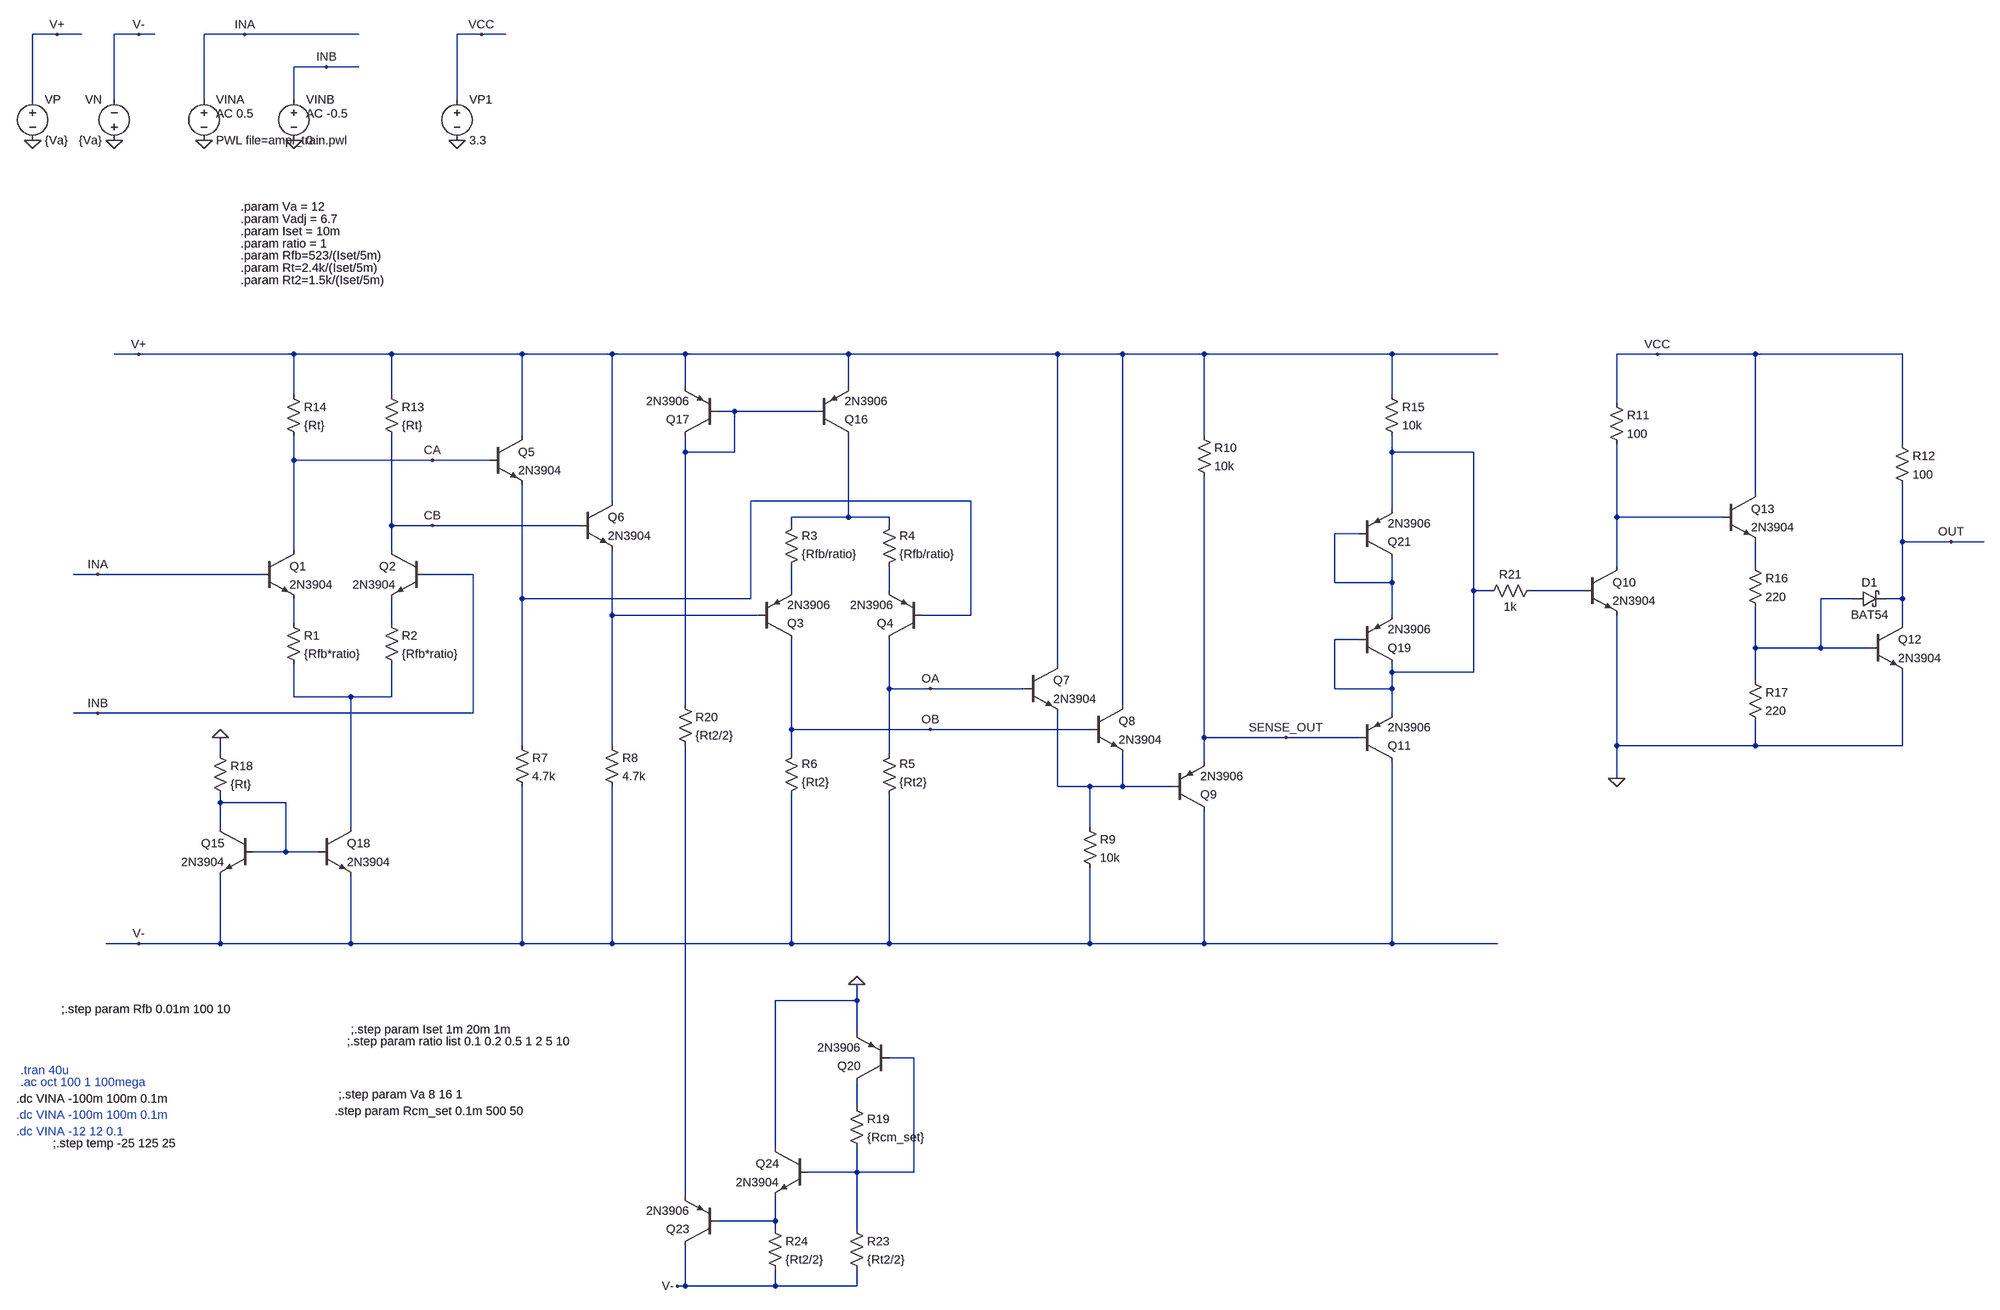
[diagram p0: schematic sense_amp_learning1.asc]
sense_amp_learning1.asc, the LTspice schematic file:
Version 4.1
SHEET 1 4868 1788
WIRE -224 -1328 -272 -1328
WIRE -176 -1328 -224 -1328
WIRE -64 -1328 -112 -1328
WIRE -32 -1328 -64 -1328
WIRE 144 -1328 64 -1328
WIRE 368 -1328 144 -1328
WIRE 608 -1328 560 -1328
WIRE 656 -1328 608 -1328
WIRE 304 -1264 240 -1264
WIRE 368 -1264 304 -1264
WIRE -272 -1200 -272 -1328
WIRE -112 -1200 -112 -1328
WIRE 64 -1200 64 -1328
WIRE 240 -1200 240 -1264
WIRE 560 -1200 560 -1328
WIRE -64 -272 -112 -272
WIRE 240 -272 -64 -272
WIRE 432 -272 240 -272
WIRE 688 -272 432 -272
WIRE 864 -272 688 -272
WIRE 1008 -272 864 -272
WIRE 1328 -272 1008 -272
WIRE 1744 -272 1328 -272
WIRE 1872 -272 1744 -272
WIRE 2032 -272 1872 -272
WIRE 2400 -272 2032 -272
WIRE 2608 -272 2400 -272
WIRE 2944 -272 2864 -272
WIRE 3216 -272 2944 -272
WIRE 3504 -272 3216 -272
WIRE 1008 -208 1008 -272
WIRE 1328 -208 1328 -272
WIRE 240 -192 240 -272
WIRE 432 -192 432 -272
WIRE 2400 -192 2400 -272
WIRE 2864 -176 2864 -272
WIRE 1104 -160 1072 -160
WIRE 1264 -160 1104 -160
WIRE 688 -112 688 -272
WIRE 2032 -112 2032 -272
WIRE 3504 -96 3504 -272
WIRE 1008 -80 1008 -112
WIRE 1104 -80 1104 -160
WIRE 1104 -80 1008 -80
WIRE 2400 -80 2400 -112
WIRE 2560 -80 2400 -80
WIRE 240 -64 240 -112
WIRE 512 -64 240 -64
WIRE 624 -64 512 -64
WIRE 3216 0 3216 -272
WIRE 864 16 864 -272
WIRE 1568 16 1136 16
WIRE 2400 32 2400 -80
WIRE 1328 48 1328 -112
WIRE 1328 48 1216 48
WIRE 1408 48 1328 48
WIRE 2864 48 2864 -96
WIRE 3152 48 2864 48
WIRE 432 64 432 -112
WIRE 512 64 432 64
WIRE 800 64 512 64
WIRE 1216 64 1216 48
WIRE 1408 64 1408 48
WIRE 2336 80 2288 80
WIRE 3504 96 3504 -16
WIRE 3600 96 3504 96
WIRE 3664 96 3600 96
WIRE 240 112 240 -64
WIRE 432 112 432 64
WIRE 2864 144 2864 48
WIRE 3216 144 3216 96
WIRE -144 160 -192 160
WIRE 176 160 -144 160
WIRE 592 160 496 160
WIRE 2288 176 2288 80
WIRE 2400 176 2400 128
WIRE 2400 176 2288 176
WIRE 1216 192 1216 144
WIRE 1408 192 1408 144
WIRE 2560 192 2560 -80
WIRE 2592 192 2560 192
WIRE 2800 192 2672 192
WIRE 688 208 688 -16
WIRE 1136 208 1136 16
WIRE 1136 208 688 208
WIRE 3408 208 3344 208
WIRE 3504 208 3504 96
WIRE 3504 208 3472 208
WIRE 864 240 864 112
WIRE 1152 240 864 240
WIRE 1568 240 1568 16
WIRE 1568 240 1472 240
WIRE 2400 240 2400 176
WIRE 240 256 240 208
WIRE 432 256 432 208
WIRE 3504 256 3504 208
WIRE 2336 288 2288 288
WIRE 3216 304 3216 224
WIRE 3344 304 3344 208
WIRE 3344 304 3216 304
WIRE 3440 304 3344 304
WIRE 1744 336 1744 -272
WIRE 2400 352 2400 336
WIRE 2560 352 2560 192
WIRE 2560 352 2400 352
WIRE 3216 368 3216 304
WIRE 1408 384 1408 288
WIRE 1488 384 1408 384
WIRE 1680 384 1488 384
WIRE 2288 384 2288 288
WIRE 2400 384 2400 352
WIRE 2400 384 2288 384
WIRE 240 400 240 336
WIRE 352 400 240 400
WIRE 432 400 432 336
WIRE 432 400 352 400
WIRE 1008 416 1008 -80
WIRE 1872 416 1872 -272
WIRE -144 432 -192 432
WIRE 592 432 592 160
WIRE 592 432 -144 432
WIRE 2400 432 2400 384
WIRE 1216 464 1216 288
WIRE 1488 464 1216 464
WIRE 1808 464 1488 464
WIRE 2032 480 2032 -32
WIRE 2192 480 2032 480
WIRE 2336 480 2192 480
WIRE 688 496 688 208
WIRE 864 496 864 240
WIRE 2864 496 2864 240
WIRE 3216 496 3216 448
WIRE 3216 496 2864 496
WIRE 3504 496 3504 352
WIRE 3504 496 3216 496
WIRE 96 512 96 480
WIRE 1216 512 1216 464
WIRE 1408 512 1408 384
WIRE 2032 528 2032 480
WIRE 2864 560 2864 496
WIRE 1744 576 1744 432
WIRE 1808 576 1744 576
WIRE 1872 576 1872 512
WIRE 1872 576 1808 576
WIRE 1968 576 1872 576
WIRE 96 608 96 592
WIRE 224 608 96 608
WIRE 96 656 96 608
WIRE 352 656 352 400
WIRE 1808 656 1808 576
WIRE 224 704 224 608
WIRE 224 704 160 704
WIRE 288 704 224 704
WIRE -64 896 -128 896
WIRE 96 896 96 752
WIRE 96 896 -64 896
WIRE 352 896 352 752
WIRE 352 896 96 896
WIRE 688 896 688 576
WIRE 688 896 352 896
WIRE 864 896 864 576
WIRE 864 896 688 896
WIRE 1216 896 1216 592
WIRE 1216 896 864 896
WIRE 1408 896 1408 592
WIRE 1408 896 1216 896
WIRE 1808 896 1808 736
WIRE 1808 896 1408 896
WIRE 2032 896 2032 624
WIRE 2032 896 1808 896
WIRE 2400 896 2400 528
WIRE 2400 896 2032 896
WIRE 2608 896 2400 896
WIRE 1344 1008 1344 976
WIRE 1344 1008 1184 1008
WIRE 1344 1072 1344 1008
WIRE 1456 1120 1408 1120
WIRE 1344 1216 1344 1168
WIRE 1184 1296 1184 1008
WIRE 1344 1344 1344 1296
WIRE 1344 1344 1248 1344
WIRE 1456 1344 1456 1120
WIRE 1456 1344 1344 1344
WIRE 1008 1392 1008 496
WIRE 1184 1440 1184 1392
WIRE 1184 1440 1072 1440
WIRE 1184 1456 1184 1440
WIRE 1344 1456 1344 1344
WIRE 1008 1568 1008 1488
WIRE 1008 1568 992 1568
WIRE 1184 1568 1184 1536
WIRE 1184 1568 1008 1568
WIRE 1344 1568 1344 1536
WIRE 1344 1568 1184 1568
FLAG -144 160 INA
FLAG -144 432 INB
FLAG -64 -272 V+
FLAG -64 896 V-
FLAG -272 -1120 0
FLAG 64 -1120 0
FLAG -112 -1120 0
FLAG 240 -1120 0
FLAG -224 -1328 V+
FLAG -64 -1328 V-
FLAG 144 -1328 INA
FLAG 304 -1264 INB
FLAG 560 -1120 0
FLAG 608 -1328 VCC
FLAG 512 -64 CA
FLAG 512 64 CB
FLAG 1488 464 OB
FLAG 1488 384 OA
FLAG 2192 480 SENSE_OUT
FLAG 2944 -272 VCC
FLAG 2864 560 0
FLAG 3600 96 OUT
FLAG 1344 976 0
FLAG 992 1568 V-
FLAG 96 480 0
SYMBOL npn 176 112 R0
SYMATTR InstName Q1
SYMATTR Value 2N3904
SYMBOL res 224 240 R0
SYMATTR InstName R1
SYMATTR Value {Rfb*ratio}
SYMBOL res 416 240 R0
SYMATTR InstName R2
SYMATTR Value {Rfb*ratio}
SYMBOL npn 496 112 M0
SYMATTR InstName Q2
SYMATTR Value 2N3904
SYMBOL res 416 -208 R0
SYMATTR InstName R13
SYMATTR Value {Rt}
SYMBOL res 224 -208 R0
SYMATTR InstName R14
SYMATTR Value {Rt}
SYMBOL voltage -272 -1216 R0
SYMATTR InstName VP
SYMATTR Value {Va}
SYMBOL voltage -112 -1104 R180
WINDOW 0 24 96 Left 2
WINDOW 3 24 16 Left 2
SYMATTR InstName VN
SYMATTR Value {Va}
SYMBOL voltage 64 -1216 R0
WINDOW 123 24 44 Left 2
WINDOW 39 0 0 Left 0
SYMATTR Value2 AC 0.5
SYMATTR InstName VINA
SYMATTR Value PWL file=ampl_train.pwl
SYMBOL voltage 240 -1216 R0
WINDOW 123 24 44 Left 2
WINDOW 39 0 0 Left 0
SYMATTR Value2 AC -0.5
SYMATTR InstName VINB
SYMATTR Value 0
SYMBOL voltage 560 -1216 R0
SYMATTR InstName VP1
SYMATTR Value 3.3
SYMBOL res 1200 160 M180
WINDOW 0 36 76 Left 2
WINDOW 3 36 40 Left 2
SYMATTR InstName R3
SYMATTR Value {Rfb/ratio}
SYMBOL res 1392 160 M180
WINDOW 0 36 76 Left 2
WINDOW 3 36 40 Left 2
SYMATTR InstName R4
SYMATTR Value {Rfb/ratio}
SYMBOL res 1392 608 M180
WINDOW 0 36 76 Left 2
WINDOW 3 36 40 Left 2
SYMATTR InstName R5
SYMATTR Value {Rt2}
SYMBOL res 1200 608 M180
WINDOW 0 36 76 Left 2
WINDOW 3 36 40 Left 2
SYMATTR InstName R6
SYMATTR Value {Rt2}
SYMBOL pnp 1152 288 M180
SYMATTR InstName Q3
SYMATTR Value 2N3906
SYMBOL pnp 1472 288 R180
SYMATTR InstName Q4
SYMATTR Value 2N3906
SYMBOL npn 624 -112 R0
SYMATTR InstName Q5
SYMATTR Value 2N3904
SYMBOL npn 800 16 R0
SYMATTR InstName Q6
SYMATTR Value 2N3904
SYMBOL res 672 480 R0
SYMATTR InstName R7
SYMATTR Value 4.7k
SYMBOL res 848 480 R0
SYMATTR InstName R8
SYMATTR Value 4.7k
SYMBOL npn 1680 336 R0
SYMATTR InstName Q7
SYMATTR Value 2N3904
SYMBOL npn 1808 416 R0
SYMATTR InstName Q8
SYMATTR Value 2N3904
SYMBOL res 1792 640 R0
SYMATTR InstName R9
SYMATTR Value 10k
SYMBOL pnp 1968 624 M180
SYMATTR InstName Q9
SYMATTR Value 2N3906
SYMBOL res 2016 -128 R0
SYMATTR InstName R10
SYMATTR Value 10k
SYMBOL npn 2800 144 R0
SYMATTR InstName Q10
SYMATTR Value 2N3904
SYMBOL res 2848 -192 R0
SYMATTR InstName R11
SYMATTR Value 100
SYMBOL pnp 2336 528 M180
SYMATTR InstName Q11
SYMATTR Value 2N3906
SYMBOL res 2384 -208 R0
SYMATTR InstName R15
SYMATTR Value 10k
SYMBOL npn 3440 256 R0
SYMATTR InstName Q12
SYMATTR Value 2N3904
SYMBOL schottky 3408 224 R270
WINDOW 0 32 32 VTop 2
WINDOW 3 0 32 VBottom 2
SYMATTR InstName D1
SYMATTR Value BAT54
SYMATTR Description Diode
SYMATTR Type diode
SYMBOL npn 3152 0 R0
SYMATTR InstName Q13
SYMATTR Value 2N3904
SYMBOL res 3488 -112 R0
SYMATTR InstName R12
SYMATTR Value 100
SYMBOL res 3200 128 R0
SYMATTR InstName R16
SYMATTR Value 220
SYMBOL res 3200 352 R0
SYMATTR InstName R17
SYMATTR Value 220
SYMBOL npn 160 656 M0
SYMATTR InstName Q15
SYMATTR Value 2N3904
SYMBOL pnp 1264 -112 M180
SYMATTR InstName Q16
SYMATTR Value 2N3906
SYMBOL pnp 1072 -112 R180
SYMATTR InstName Q17
SYMATTR Value 2N3906
SYMBOL npn 288 656 R0
SYMATTR InstName Q18
SYMATTR Value 2N3904
SYMBOL res 80 496 R0
SYMATTR InstName R18
SYMATTR Value {Rt}
SYMBOL pnp 2336 336 M180
SYMATTR InstName Q19
SYMATTR Value 2N3906
SYMBOL res 2688 176 R90
WINDOW 0 0 56 VBottom 2
WINDOW 3 32 56 VTop 2
SYMATTR InstName R21
SYMATTR Value 1k
SYMBOL pnp 2336 128 M180
SYMATTR InstName Q21
SYMATTR Value 2N3906
SYMBOL res 992 400 R0
SYMATTR InstName R20
SYMATTR Value {Rt2/2}
SYMBOL pnp 1408 1168 R180
SYMATTR InstName Q20
SYMATTR Value 2N3906
SYMBOL res 1328 1440 R0
SYMATTR InstName R23
SYMATTR Value {Rt2/2}
SYMBOL pnp 1072 1488 R180
SYMATTR InstName Q23
SYMATTR Value 2N3906
SYMBOL npn 1248 1296 M0
SYMATTR InstName Q24
SYMATTR Value 2N3904
SYMBOL res 1168 1440 R0
SYMATTR InstName R24
SYMATTR Value {Rt2/2}
SYMBOL res 1328 1200 R0
SYMATTR InstName R19
SYMATTR Value {Rcm_set}
TEXT -304 1200 Left 2 !.dc VINA -100m 100m 0.1m
TEXT -304 1232 Left 2 ;.dc VINA -100m 100m 0.1m
TEXT -232 1288 Left 2 !;.step temp -25 125 25
TEXT -216 1024 Left 2 !;.step param Rfb 0.01m 100 10
TEXT 136 -472 Left 2 !.param Rfb=523/(Iset/5m)
TEXT 136 -448 Left 2 !.param Rt=2.4k/(Iset/5m)
TEXT -304 1264 Left 2 ;.dc VINA -12 12 0.1
TEXT -296 1168 Left 2 ;.ac oct 100 1 100mega
TEXT 344 1088 Left 2 !;.step param ratio list 0.1 0.2 0.5 1 2 5 10
TEXT 136 -496 Left 2 !.param ratio = 1
TEXT 136 -520 Left 2 !.param Iset = 10m
TEXT 352 1064 Left 2 !;.step param Iset 1m 20m 1m
TEXT -296 1144 Left 2 ;.tran 40u
TEXT 136 -568 Left 2 !.param Va = 12
TEXT 136 -544 Left 2 !.param Vadj = 6.7
TEXT 328 1192 Left 2 !;.step param Va 8 16 1
TEXT 320 1224 Left 2 !.step param Rcm_set 0.1m 500 50
TEXT 136 -424 Left 2 !.param Rt2=1.5k/(Iset/5m)

The netlist it stands for:
* sense_amp_learning1.asc
Q1 CA INA N013 0 2N3904
R1 N013 N015 {Rfb*ratio}
R2 N014 N015 {Rfb*ratio}
Q2 CB INB N014 0 2N3904
R13 V+ CB {Rt}
R14 V+ CA {Rt}
VP V+ 0 {Va}
VN 0 V- {Va}
VINA INA 0 PWL file=ampl_train.pwl AC 0.5
VINB INB 0 0 AC -0.5
VP1 VCC 0 3.3
R3 N008 N004 {Rfb/ratio}
R4 N009 N004 {Rfb/ratio}
R5 V- OA {Rt2}
R6 V- OB {Rt2}
Q3 OB N012 N008 0 2N3906
Q4 OA N003 N009 0 2N3906
Q5 V+ CA N003 0 2N3904
Q6 V+ CB N012 0 2N3904
R7 N003 V- 4.7k
R8 N012 V- 4.7k
Q7 V+ OA N016 0 2N3904
Q8 V+ OB N016 0 2N3904
R9 N016 V- 10k
Q9 V- N016 SENSE_OUT 0 2N3906
R10 V+ SENSE_OUT 10k
Q10 N005 N010 0 0 2N3904
R11 VCC N005 100
Q11 V- SENSE_OUT N002 0 2N3906
R15 V+ N002 10k
Q12 OUT N011 0 0 2N3904
D1 N011 OUT BAT54
Q13 VCC N005 N007 0 2N3904
R12 VCC OUT 100
R16 N007 N011 220
R17 N011 0 220
Q15 N017 N017 V- 0 2N3904
Q16 N004 N001 V+ 0 2N3906
Q17 N001 N001 V+ 0 2N3906
Q18 N015 N017 V- 0 2N3904
R18 0 N017 {Rt}
Q19 N002 N002 N006 0 2N3906
R21 N010 N002 1k
Q21 N006 N006 N002 0 2N3906
R20 N001 N020 {Rt2/2}
Q20 N019 N018 0 0 2N3906
R23 N018 V- {Rt2/2}
Q23 V- N021 N020 0 2N3906
Q24 0 N018 N021 0 2N3904
R24 N021 V- {Rt2/2}
R19 N019 N018 {Rcm_set}
.model D D
.lib standard.dio
.model NPN NPN
.model PNP PNP
.lib standard.bjt
.dc VINA -100m 100m 0.1m
* .dc VINA -100m 100m 0.1m
;.step temp -25 125 25
;.step param Rfb 0.01m 100 10
.param Rfb=523/(Iset/5m)
.param Rt=2.4k/(Iset/5m)
* .dc VINA -12 12 0.1
* .ac oct 100 1 100mega
;.step param ratio list 0.1 0.2 0.5 1 2 5 10
.param ratio = 1
.param Iset = 10m
;.step param Iset 1m 20m 1m
* .tran 40u
.param Va = 12
.param Vadj = 6.7
;.step param Va 8 16 1
.step param Rcm_set 0.1m 500 50
.param Rt2=1.5k/(Iset/5m)
.backanno
.end